# Altium schematic sheet FPGA.SchDoc: FPGA
size A2; Author: M.Beldyga; CompanyName: WUT ISE; DrawnBy: M.Beldyga; Organization: WUT ISE; Address1: PW ISE; Address2: Nowowiejska 15/19 00-665 Warsaw; Address3: micbeldyga@gmail.com; SheetNumber: 10; SheetTotal: 10; ModifiedBy: -; CheckedDate: -; DivGrp: WUT ISE; Designer: M.Beldyga; ModifiedDate: -; ProjectName: Sensor Box
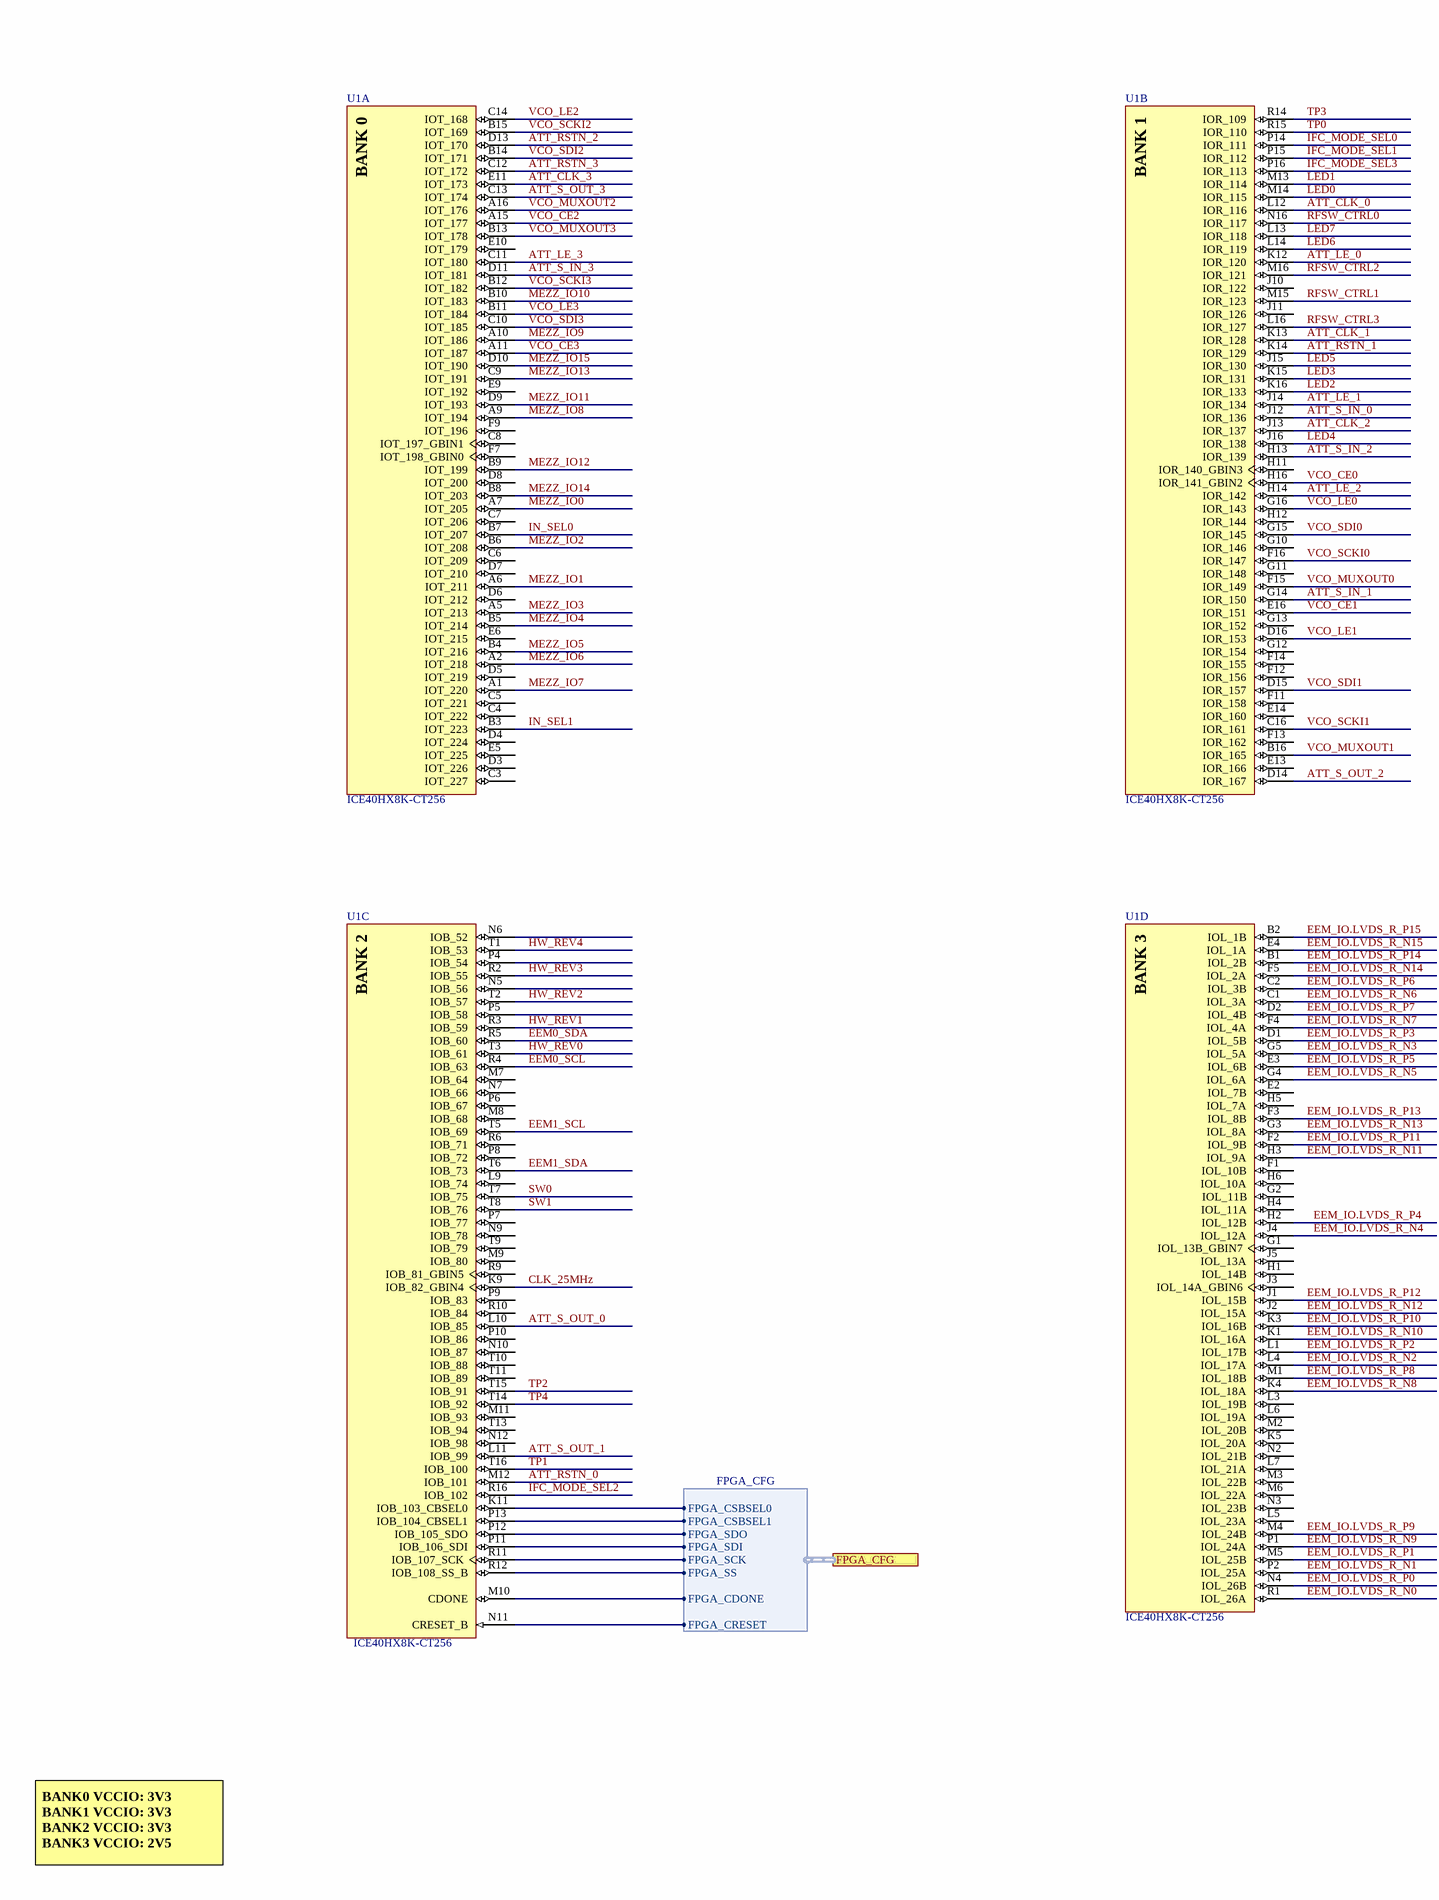
[diagram p0: FPGA.SchDoc, left]
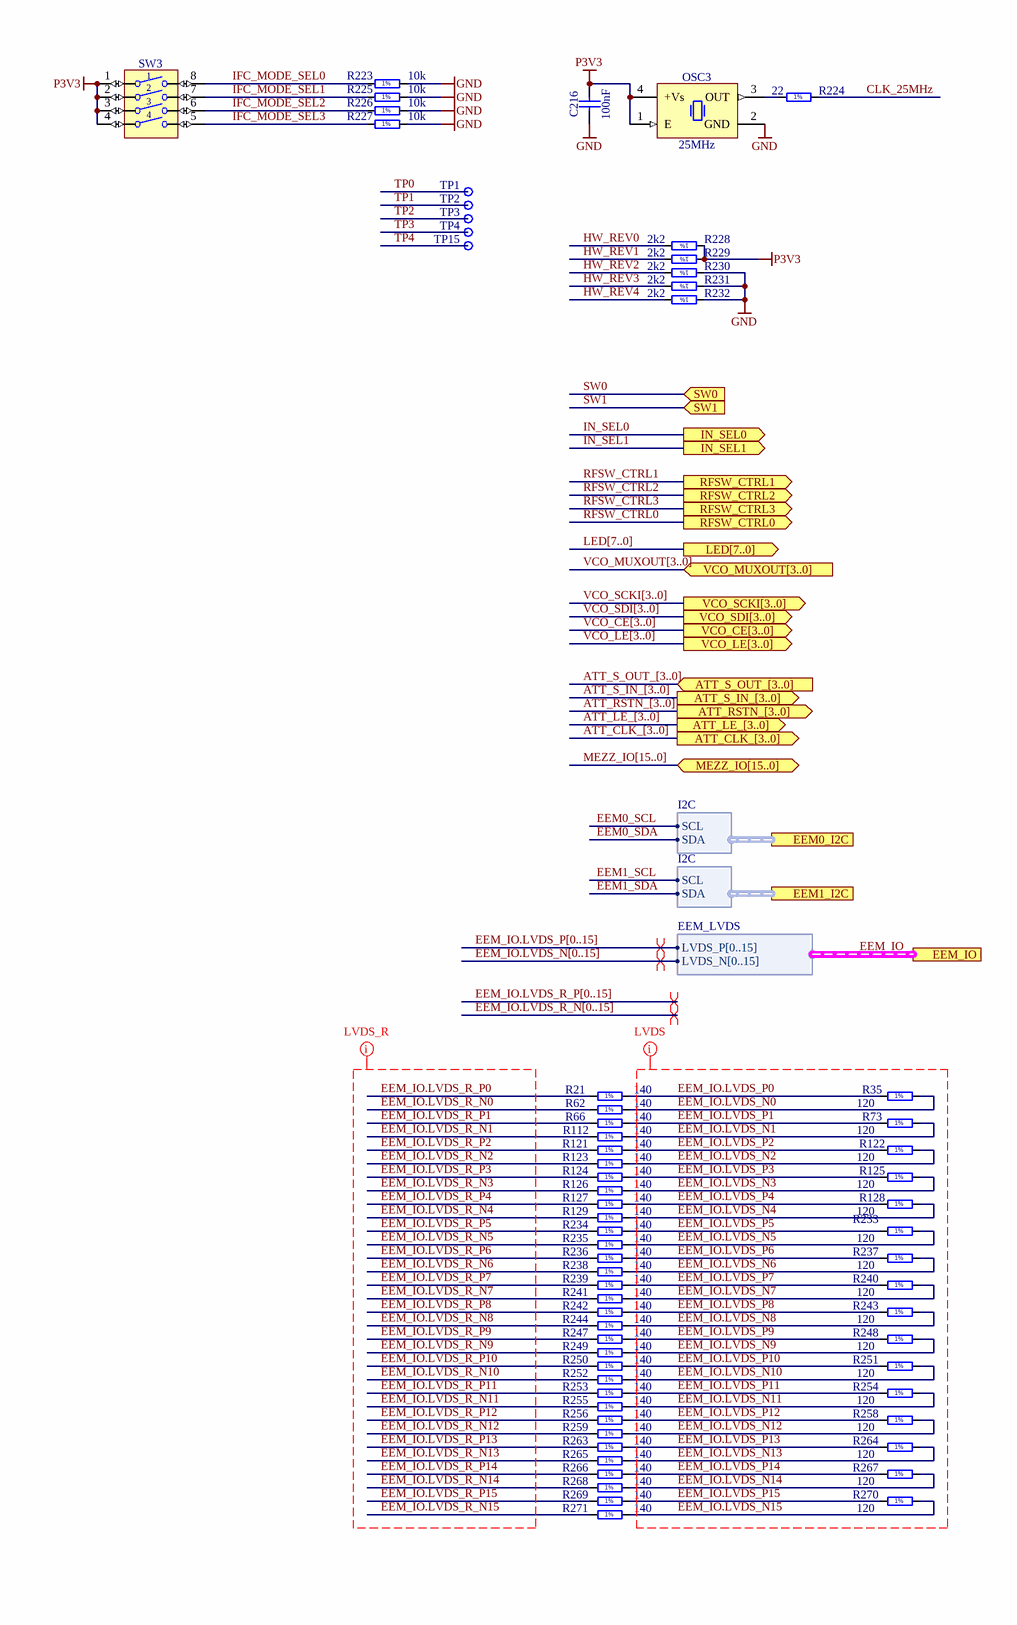
[diagram p1: FPGA.SchDoc, right]

## Parts
C216  100nF  [CAPC1005X55N]
OSC3  25MHz  [OSC_IQD_CFPS-39]
R21  140  [RESC0603X28N]
R35  120  [RESC1005X40N]
R62  140  [RESC0603X28N]
R66  140  [RESC0603X28N]
R73  120  [RESC1005X40N]
R112  140  [RESC0603X28N]
R121  140  [RESC0603X28N]
R122  120  [RESC1005X40N]
R123  140  [RESC0603X28N]
R124  140  [RESC0603X28N]
R125  120  [RESC1005X40N]
R126  140  [RESC0603X28N]
R127  140  [RESC0603X28N]
R128  120  [RESC1005X40N]
R129  140  [RESC0603X28N]
R223  10k  [RESC1005X40N]
R224  22  [RESC1005X40N]
R225  10k  [RESC1005X40N]
R226  10k  [RESC1005X40N]
R227  10k  [RESC1005X40N]
R228  2k2  [RESC1005X40N]
R229  2k2  [RESC1005X40N]
R230  2k2  [RESC1005X40N]
R231  2k2  [RESC1005X40N]
R232  2k2  [RESC1005X40N]
R233  120  [RESC1005X40N]
R234  140  [RESC0603X28N]
R235  140  [RESC0603X28N]
R236  140  [RESC0603X28N]
R237  120  [RESC1005X40N]
R238  140  [RESC0603X28N]
R239  140  [RESC0603X28N]
R240  120  [RESC1005X40N]
R241  140  [RESC0603X28N]
R242  140  [RESC0603X28N]
R243  120  [RESC1005X40N]
R244  140  [RESC0603X28N]
R247  140  [RESC0603X28N]
R248  120  [RESC1005X40N]
R249  140  [RESC0603X28N]
R250  140  [RESC0603X28N]
R251  120  [RESC1005X40N]
R252  140  [RESC0603X28N]
R253  140  [RESC0603X28N]
R254  120  [RESC1005X40N]
R255  140  [RESC0603X28N]
R256  140  [RESC0603X28N]
R258  120  [RESC1005X40N]
R259  140  [RESC0603X28N]
R263  140  [RESC0603X28N]
R264  120  [RESC1005X40N]
R265  140  [RESC0603X28N]
R266  140  [RESC0603X28N]
R267  120  [RESC1005X40N]
R268  140  [RESC0603X28N]
R269  140  [RESC0603X28N]
R270  120  [RESC1005X40N]
R271  140  [RESC0603X28N]
SW3  Switch  [SW_TYCO_1571983-4]  (value not drawn)
TP1  Test Point  [TPS127]  (value not drawn)
TP2  Test Point  [TPS127]  (value not drawn)
TP3  Test Point  [TPS127]  (value not drawn)
TP4  Test Point  [TPS127]  (value not drawn)
TP15  Test Point  [TPS127]  (value not drawn)
U1  ICE40HX8K-CT256  [LATC-caBGA-256]  (parts A,B,C,D of 5)

## Ports
ATT_CLK_[3..0] (out), ATT_LE_[3..0] (out), ATT_RSTN_[3..0] (out), ATT_S_IN_[3..0] (out), ATT_S_OUT_[3..0] (in), EEM0_I2C (harness I2C), EEM1_I2C (harness I2C), EEM_IO (harness EEM_LVDS), FPGA_CFG (harness FPGA_CFG), IN_SEL0 (out), IN_SEL1 (out), LED[7..0] (out), MEZZ_IO[15..0] (bidir), RFSW_CTRL0 (out), RFSW_CTRL1 (out), RFSW_CTRL2 (out), RFSW_CTRL3 (out), SW0 (in), SW1 (in), VCO_CE[3..0] (out), VCO_LE[3..0] (out), VCO_MUXOUT[3..0] (in), VCO_SCKI[3..0] (out), VCO_SDI[3..0] (out)

## Harnesses
FPGA_CFG: FPGA_CSBSEL0, FPGA_CSBSEL1, FPGA_SDO, FPGA_SDI, FPGA_SCK, FPGA_SS, FPGA_CDONE, FPGA_CRESET
I2C: SDA, SCL
EEM_LVDS: LVDS_P[0..15], LVDS_N[0..15]

## Nets
GND: C216.1 OSC3.2(GND) R223.2 R225.2 R226.2 R227.2 R230.1 R231.1 R232.1
P3V3: C216.2 OSC3.1(E) OSC3.4(+Vs) R228.1 R229.1 SW3.1 SW3.2 SW3.3 SW3.4
ATT_CLK_0: U1.L12(IOR_116)
ATT_CLK_1: U1.K13(IOR_128)
ATT_CLK_2: U1.J13(IOR_137)
ATT_CLK_3: U1.E11(IOT_173)
ATT_LE_0: U1.K12(IOR_120)
ATT_LE_1: U1.J14(IOR_134)
ATT_LE_2: U1.H14(IOR_142)
ATT_LE_3: U1.C11(IOT_180)
ATT_RSTN_0: U1.M12(IOB_101)
ATT_RSTN_1: U1.K14(IOR_129)
ATT_RSTN_2: U1.D13(IOT_170)
ATT_RSTN_3: U1.C12(IOT_172)
ATT_S_IN_0: U1.J12(IOR_136)
ATT_S_IN_1: U1.G14(IOR_150)
ATT_S_IN_2: U1.H13(IOR_139)
ATT_S_IN_3: U1.D11(IOT_181)
ATT_S_OUT_0: U1.L10(IOB_85)
ATT_S_OUT_1: U1.L11(IOB_99)
ATT_S_OUT_2: U1.D14(IOR_167)
ATT_S_OUT_3: U1.C13(IOT_174)
CLK_25MHz: R224.2 U1.K9(IOB_82_GBIN4)
EEM0_SCL: U1.R4(IOB_63) ; port EEM0_I2C.SCL
EEM0_SDA: U1.R5(IOB_60) ; port EEM0_I2C.SDA
EEM1_SCL: U1.T5(IOB_69) ; port EEM1_I2C.SCL
EEM1_SDA: U1.T6(IOB_73) ; port EEM1_I2C.SDA
EEM_IO.LVDS_N0: R35.2 R62.2
EEM_IO.LVDS_N1: R73.2 R112.2
EEM_IO.LVDS_N2: R122.2 R123.2
EEM_IO.LVDS_N3: R125.2 R126.2
EEM_IO.LVDS_N4: R128.2 R129.2
EEM_IO.LVDS_N5: R233.2 R235.2
EEM_IO.LVDS_N6: R237.2 R238.2
EEM_IO.LVDS_N7: R240.2 R241.2
EEM_IO.LVDS_N8: R243.2 R244.2
EEM_IO.LVDS_N9: R248.2 R249.2
EEM_IO.LVDS_N10: R251.2 R252.2
EEM_IO.LVDS_N11: R254.2 R255.2
EEM_IO.LVDS_N12: R258.2 R259.2
EEM_IO.LVDS_N13: R264.2 R265.2
EEM_IO.LVDS_N14: R267.2 R268.2
EEM_IO.LVDS_N15: R270.2 R271.2
EEM_IO.LVDS_P0: R21.2 R35.1
EEM_IO.LVDS_P1: R66.2 R73.1
EEM_IO.LVDS_P2: R121.2 R122.1
EEM_IO.LVDS_P3: R124.2 R125.1
EEM_IO.LVDS_P4: R127.2 R128.1
EEM_IO.LVDS_P5: R233.1 R234.2
EEM_IO.LVDS_P6: R236.2 R237.1
EEM_IO.LVDS_P7: R239.2 R240.1
EEM_IO.LVDS_P8: R242.2 R243.1
EEM_IO.LVDS_P9: R247.2 R248.1
EEM_IO.LVDS_P10: R250.2 R251.1
EEM_IO.LVDS_P11: R253.2 R254.1
EEM_IO.LVDS_P12: R256.2 R258.1
EEM_IO.LVDS_P13: R263.2 R264.1
EEM_IO.LVDS_P14: R266.2 R267.1
EEM_IO.LVDS_P15: R269.2 R270.1
EEM_IO.LVDS_R_N0: R62.1 U1.R1(IOL_26A)
EEM_IO.LVDS_R_N1: R112.1 U1.P2(IOL_25A)
EEM_IO.LVDS_R_N2: R123.1 U1.L4(IOL_17A)
EEM_IO.LVDS_R_N3: R126.1 U1.G5(IOL_5A)
EEM_IO.LVDS_R_N4: R129.1 U1.J4(IOL_12A)
EEM_IO.LVDS_R_N5: R235.1 U1.G4(IOL_6A)
EEM_IO.LVDS_R_N6: R238.1 U1.C1(IOL_3A)
EEM_IO.LVDS_R_N7: R241.1 U1.F4(IOL_4A)
EEM_IO.LVDS_R_N8: R244.1 U1.K4(IOL_18A)
EEM_IO.LVDS_R_N9: R249.1 U1.P1(IOL_24A)
EEM_IO.LVDS_R_N10: R252.1 U1.K1(IOL_16A)
EEM_IO.LVDS_R_N11: R255.1 U1.H3(IOL_9A)
EEM_IO.LVDS_R_N12: R259.1 U1.J2(IOL_15A)
EEM_IO.LVDS_R_N13: R265.1 U1.G3(IOL_8A)
EEM_IO.LVDS_R_N14: R268.1 U1.F5(IOL_2A)
EEM_IO.LVDS_R_N15: R271.1 U1.E4(IOL_1A)
EEM_IO.LVDS_R_P0: R21.1 U1.N4(IOL_26B)
EEM_IO.LVDS_R_P1: R66.1 U1.M5(IOL_25B)
EEM_IO.LVDS_R_P2: R121.1 U1.L1(IOL_17B)
EEM_IO.LVDS_R_P3: R124.1 U1.D1(IOL_5B)
EEM_IO.LVDS_R_P4: R127.1 U1.H2(IOL_12B)
EEM_IO.LVDS_R_P5: R234.1 U1.E3(IOL_6B)
EEM_IO.LVDS_R_P6: R236.1 U1.C2(IOL_3B)
EEM_IO.LVDS_R_P7: R239.1 U1.D2(IOL_4B)
EEM_IO.LVDS_R_P8: R242.1 U1.M1(IOL_18B)
EEM_IO.LVDS_R_P9: R247.1 U1.M4(IOL_24B)
EEM_IO.LVDS_R_P10: R250.1 U1.K3(IOL_16B)
EEM_IO.LVDS_R_P11: R253.1 U1.F2(IOL_9B)
EEM_IO.LVDS_R_P12: R256.1 U1.J1(IOL_15B)
EEM_IO.LVDS_R_P13: R263.1 U1.F3(IOL_8B)
EEM_IO.LVDS_R_P14: R266.1 U1.B1(IOL_2B)
EEM_IO.LVDS_R_P15: R269.1 U1.B2(IOL_1B)
HW_REV0: R228.2 U1.T3(IOB_61)
HW_REV1: R229.2 U1.R3(IOB_59)
HW_REV2: R230.2 U1.T2(IOB_57)
HW_REV3: R231.2 U1.R2(IOB_55)
HW_REV4: R232.2 U1.T1(IOB_53)
IFC_MODE_SEL0: R223.1 SW3.8 U1.P14(IOR_111)
IFC_MODE_SEL1: R225.1 SW3.7 U1.P15(IOR_112)
IFC_MODE_SEL2: R226.1 SW3.6 U1.R16(IOB_102)
IFC_MODE_SEL3: R227.1 SW3.5 U1.P16(IOR_113)
IN_SEL0: U1.B7(IOT_207) ; port IN_SEL0
IN_SEL1: U1.B3(IOT_223) ; port IN_SEL1
LED0: U1.M14(IOR_115)
LED1: U1.M13(IOR_114)
LED2: U1.K16(IOR_133)
LED3: U1.K15(IOR_131)
LED4: U1.J16(IOR_138)
LED5: U1.J15(IOR_130)
LED6: U1.L14(IOR_119)
LED7: U1.L13(IOR_118)
MEZZ_IO0: U1.A7(IOT_205)
MEZZ_IO1: U1.A6(IOT_211)
MEZZ_IO2: U1.B6(IOT_208)
MEZZ_IO3: U1.A5(IOT_213)
MEZZ_IO4: U1.B5(IOT_214)
MEZZ_IO5: U1.B4(IOT_216)
MEZZ_IO6: U1.A2(IOT_218)
MEZZ_IO7: U1.A1(IOT_220)
MEZZ_IO8: U1.A9(IOT_194)
MEZZ_IO9: U1.A10(IOT_186)
MEZZ_IO10: U1.B10(IOT_183)
MEZZ_IO11: U1.D9(IOT_193)
MEZZ_IO12: U1.B9(IOT_199)
MEZZ_IO13: U1.C9(IOT_191)
MEZZ_IO14: U1.B8(IOT_203)
MEZZ_IO15: U1.D10(IOT_190)
RFSW_CTRL0: U1.N16(IOR_117) ; port RFSW_CTRL0
RFSW_CTRL1: U1.M15(IOR_123) ; port RFSW_CTRL1
RFSW_CTRL2: U1.M16(IOR_121) ; port RFSW_CTRL2
RFSW_CTRL3: U1.L16(IOR_127) ; port RFSW_CTRL3
SW0: U1.T7(IOB_75) ; port SW0
SW1: U1.T8(IOB_76) ; port SW1
TP0: TP1.1 U1.R15(IOR_110)
TP1: TP2.1 U1.T16(IOB_100)
TP2: TP3.1 U1.T15(IOB_91)
TP3: TP4.1 U1.R14(IOR_109)
TP4: TP15.1 U1.T14(IOB_92)
VCO_CE0: U1.H16(IOR_141_GBIN2)
VCO_CE1: U1.E16(IOR_151)
VCO_CE2: U1.A15(IOT_177)
VCO_CE3: U1.A11(IOT_187)
VCO_LE0: U1.G16(IOR_143)
VCO_LE1: U1.D16(IOR_153)
VCO_LE2: U1.C14(IOT_168)
VCO_LE3: U1.B11(IOT_184)
VCO_MUXOUT0: U1.F15(IOR_149)
VCO_MUXOUT1: U1.B16(IOR_165)
VCO_MUXOUT2: U1.A16(IOT_176)
VCO_MUXOUT3: U1.B13(IOT_178)
VCO_SCKI0: U1.F16(IOR_147)
VCO_SCKI1: U1.C16(IOR_161)
VCO_SCKI2: U1.B15(IOT_169)
VCO_SCKI3: U1.B12(IOT_182)
VCO_SDI0: U1.G15(IOR_145)
VCO_SDI1: U1.D15(IOR_157)
VCO_SDI2: U1.B14(IOT_171)
VCO_SDI3: U1.C10(IOT_185)
NetOSC3_3: OSC3.3(OUT) R224.1
NetU1_K11: U1.K11(IOB_103_CBSEL0) ; port FPGA_CFG.FPGA_CSBSEL0
NetU1_M10: U1.M10(CDONE) ; port FPGA_CFG.FPGA_CDONE
NetU1_N11: U1.N11(CRESET_B) ; port FPGA_CFG.FPGA_CRESET
NetU1_P11: U1.P11(IOB_106_SDI) ; port FPGA_CFG.FPGA_SDI
NetU1_P12: U1.P12(IOB_105_SDO) ; port FPGA_CFG.FPGA_SDO
NetU1_P13: U1.P13(IOB_104_CBSEL1) ; port FPGA_CFG.FPGA_CSBSEL1
NetU1_R11: U1.R11(IOB_107_SCK) ; port FPGA_CFG.FPGA_SCK
NetU1_R12: U1.R12(IOB_108_SS_B) ; port FPGA_CFG.FPGA_SS

Not connected (* = marked no-connect by the designer): U1 C3(IOT_227) C4(IOT_222) C5(IOT_221) C6(IOT_209) C7(IOT_206) C8(IOT_197_GBIN1) D3(IOT_226) D4(IOT_224) D5(IOT_219) D6(IOT_212) D7(IOT_210) D8(IOT_200) E2(IOL_7B) E5(IOT_225) E6(IOT_215) E9(IOT_192) E10(IOT_179) E13(IOR_166) E14(IOR_160) F1(IOL_10B) F7(IOT_198_GBIN0) F9(IOT_196) F11(IOR_158) F12(IOR_156) F13(IOR_162) F14(IOR_155) G1(IOL_13B_GBIN7) G2(IOL_11B) G10(IOR_146) G11(IOR_148) G12(IOR_154) G13(IOR_152) H1(IOL_14B) H4(IOL_11A) H5(IOL_7A) H6(IOL_10A) H11(IOR_140_GBIN3) H12(IOR_144) J3(IOL_14A_GBIN6) J5(IOL_13A) J10(IOR_122) J11(IOR_126) K5(IOL_20A) L3(IOL_19B) L5(IOL_23A) L6(IOL_19A) L7(IOL_21A) L9(IOB_74) M2(IOL_20B) M3(IOL_22B) M6(IOL_22A) M7(IOB_64) M8(IOB_68) M9(IOB_80) M11(IOB_93) N2(IOL_21B) N3(IOL_23B) N5(IOB_56) N6(IOB_52) N7(IOB_66) N9(IOB_78) N10(IOB_87) N12(IOB_98) P4(IOB_54) P5(IOB_58) P6(IOB_67) P7(IOB_77) P8(IOB_72) P9(IOB_83) P10(IOB_86) R6(IOB_71) R9(IOB_81_GBIN5) R10(IOB_84) T9(IOB_79) T10(IOB_88) T11(IOB_89) T13(IOB_94)

## Buses and harness runs
bus ATT_CLK_[3..0] = port ATT_CLK_[3..0]
bus ATT_LE_[3..0] = port ATT_LE_[3..0]
bus ATT_RSTN_[3..0] = port ATT_RSTN_[3..0]
bus ATT_S_IN_[3..0] = port ATT_S_IN_[3..0]
bus ATT_S_OUT_[3..0] = port ATT_S_OUT_[3..0]
bus EEM_IO.LVDS_N[0..15]
bus EEM_IO.LVDS_P[0..15]
bus EEM_IO.LVDS_R_N[0..15]
bus EEM_IO.LVDS_R_P[0..15]
bus LED[7..0] = port LED[7..0]
bus MEZZ_IO[15..0] = port MEZZ_IO[15..0]
bus VCO_CE[3..0] = port VCO_CE[3..0]
bus VCO_LE[3..0] = port VCO_LE[3..0]
bus VCO_MUXOUT[3..0] = port VCO_MUXOUT[3..0]
bus VCO_SCKI[3..0] = port VCO_SCKI[3..0]
bus VCO_SDI[3..0] = port VCO_SDI[3..0]
harness EEM_IO = port EEM_IO

## Layout directives
differential pair; differential pair class Diff_100Ohm: (no net found under the mark)
net class LVDS: EEM_IO.LVDS_N0, EEM_IO.LVDS_N1, EEM_IO.LVDS_N2, EEM_IO.LVDS_N3, EEM_IO.LVDS_N4, EEM_IO.LVDS_N5, EEM_IO.LVDS_N6, EEM_IO.LVDS_N7, EEM_IO.LVDS_N8, EEM_IO.LVDS_N9, EEM_IO.LVDS_N10, EEM_IO.LVDS_N11, EEM_IO.LVDS_N12, EEM_IO.LVDS_N13, EEM_IO.LVDS_N14, EEM_IO.LVDS_N15, EEM_IO.LVDS_P0, EEM_IO.LVDS_P1, EEM_IO.LVDS_P2, EEM_IO.LVDS_P3, EEM_IO.LVDS_P4, EEM_IO.LVDS_P5, EEM_IO.LVDS_P6, EEM_IO.LVDS_P7, EEM_IO.LVDS_P8, EEM_IO.LVDS_P9, EEM_IO.LVDS_P10, EEM_IO.LVDS_P11, EEM_IO.LVDS_P12, EEM_IO.LVDS_P13, EEM_IO.LVDS_P14, EEM_IO.LVDS_P15
net class LVDS_R: EEM_IO.LVDS_R_N0, EEM_IO.LVDS_R_N1, EEM_IO.LVDS_R_N2, EEM_IO.LVDS_R_N3, EEM_IO.LVDS_R_N4, EEM_IO.LVDS_R_N5, EEM_IO.LVDS_R_N6, EEM_IO.LVDS_R_N7, EEM_IO.LVDS_R_N8, EEM_IO.LVDS_R_N9, EEM_IO.LVDS_R_N10, EEM_IO.LVDS_R_N11, EEM_IO.LVDS_R_N12, EEM_IO.LVDS_R_N13, EEM_IO.LVDS_R_N14, EEM_IO.LVDS_R_N15, EEM_IO.LVDS_R_P0, EEM_IO.LVDS_R_P1, EEM_IO.LVDS_R_P2, EEM_IO.LVDS_R_P3, EEM_IO.LVDS_R_P4, EEM_IO.LVDS_R_P5, EEM_IO.LVDS_R_P6, EEM_IO.LVDS_R_P7, EEM_IO.LVDS_R_P8, EEM_IO.LVDS_R_P9, EEM_IO.LVDS_R_P10, EEM_IO.LVDS_R_P11, EEM_IO.LVDS_R_P12, EEM_IO.LVDS_R_P13, EEM_IO.LVDS_R_P14, EEM_IO.LVDS_R_P15

## Notes on the sheet
- BANK0 VCCIO: 3V3
  BANK1 VCCIO: 3V3
  BANK2 VCCIO: 3V3
  BANK3 VCCIO: 2V5
- Project/Equipment
- Document
- Designer
- Drawn by
- Check.by
- Last Mod.
- Contact
- File
- Print Date
- Sheet
- Size
- A2
- of
- Rev
- (in symbol CMP-0962-00001-1, part A) BANK 0
- (in symbol CMP-0962-00001-1, part B) BANK 1
- (in symbol CMP-0962-00001-1, part C) BANK 2
- (in symbol CMP-0962-00001-1, part D) BANK 3
- (in symbol R0201_140R_1%_0.05W_200PPM) 1%
- (in symbol R0402_2K2_1%_0.0625W_100PPM) 1%
- (in symbol R0402_10K_1%_0.0625W_100PPM) 1%
- (in symbol R0402_22R_1%_0.0625W_100PPM) 1%
- (in symbol R0402_120R_1%_0.0625W_100PPM) 1%

## Library data of the parts
C216 = CC0402_100NF_16V_10%_X5R: Non-polarised capacitor; Part Description: SMD Multilayer Chip Ceramic Capacitor; Manufacturer: GENERIC; Manufacturer1 Part Number: GRM155R61C104KA88D; Voltage: 16V; TC: X5R; Tolerance: ±10%; Part Number: CC0402_100NF_16V_10%_X5R; Component Kind: Standard; Component Type: Standard; Pin Count: 2; Value: 100nF; Status: None; Manufacturer Part Number: CC0402_100NF_16V_10%_X5R; Case: 0402; Mounted: Yes; Socket: No; SMD: Yes; Sense: No; Manufacturer1 Example: MURATA; Manufacturer1 ComponentHeight: 0.55mm; HelpURL: \\cern.ch\dfs\Applications\Altium\Datasheets\CC0402_X5R_MURATA_GRM.pdf; Author: CERN DEM JLC; CreateDate: 10.12.2013; LatestRevisionDate: 10.12.2013
OSC3 = OSC_25MHZ_IQD_LFSPXO025165: Oscillator 4 pins 1=E 2=GND 3=OUT 4=+Vs; Part Description: 3.3V, ±50ppm, 15pF, -40 to 85°C, CMOS Surface Mount Clock Oscillator (CFPS-39 Series); Manufacturer: IQD FREQUENCY PRODUCTS; PressFit: No; Bonding: No; Part Number: OSC_25MHZ_IQD_LFSPXO025165; Component Kind: Standard; Component Type: Standard; PackageDescription: Oscillator, Corner Concave, 2.20mm Pitch, 4 Pins, 2.70mm L X 3.40mm W X 1.20mm H, CFPS-39 Series; Value: 25MHz; Manufacturer Part Number: LFSPXO025165; Pin Count: 4; Mounted: Yes; Socket: No; SMD: Yes; Sense: No; ComponentHeight: 1.2mm; HelpURL: \\cern.ch\dfs\Applications\Altium\Datasheets\OSC_IQD_LFSPXO025165.pdf; Author: CERN DEM JLC; CreateDate: 02.12.2010; LatestRevisionDate: 03.11.2016
R21 R62 R66 R112 R121 R123 R124 R126 R127 R129 R234-R236 R238 R239 R241 R242 R244 R247 R249 R250 R252 R253 R255 R256 R259 R263 R265 R266 R268 R269 R271 = R0201_140R_1%_0.05W_200PPM: Resistor - 1%; Part Description: Thick Film Chip Resistor; Manufacturer: GENERIC; Manufacturer1 Part Number: CRCW0201140RFNED; Power: 0.05W; TC: ±200ppm/°C; PressFit: No; Part Number: R0201_140R_1%_0.05W_200PPM; Component Kind: Standard; Component Type: Standard; Pin Count: 2; Value: 140; Status: Not Recommended; Tolerance: ±1%; Manufacturer Part Number: R0201_140R_1%_0.05W_200PPM; Case: 0201; Mounted: Yes; Sense: No; Socket: No; SMD: Yes; Manufacturer1 Example: VISHAY; Manufacturer1 ComponentHeight: 0.27mm; HelpURL: \\cern.ch\dfs\Applications\Altium\Datasheets\R0201_VISHAY_CRCW e3.pdf; Author: CERN DEM MR; CreateDate: 26/01/2016; LatestRevisionDate: 26/01/2016
R35 R73 R122 R125 R128 R233 R237 R240 R243 R248 R251 R254 R258 R264 R267 R270 = R0402_120R_1%_0.0625W_100PPM: Resistor - 1%; Part Description: General Purpose Thick Film Chip Resistor; Manufacturer: GENERIC; Manufacturer1 Part Number: 232270671201L; TC: ±100ppm/°C; PressFit: No; Part Number: R0402_120R_1%_0.0625W_100PPM; Component Kind: Standard; Component Type: Standard; Pin Count: 2; Value: 120; Status: Not Recommended; Power: 0.0625W; Tolerance: ±1%; Manufacturer Part Number: R0402_120R_1%_0.0625W_100PPM; Case: 0402; Mounted: Yes; Sense: No; Socket: No; SMD: Yes; Manufacturer1 Example: YAGEO PHYCOMP; Manufacturer1 ComponentHeight: 0.4mm; HelpURL: \\cern.ch\dfs\Applications\Altium\Datasheets\R0402_Phycomp_RC0402.pdf; Author: CERN DEM JLC; CreateDate: 03.12.2007; LatestRevisionDate: 17.10.2012
R223 R225-R227 = R0402_10K_1%_0.0625W_100PPM: Resistor - 1%; Part Description: General Purpose Thick Film Chip Resistor; Manufacturer: GENERIC; Manufacturer1 Part Number: 232270671003L; TC: ±100ppm/°C; Part Number: R0402_10K_1%_0.0625W_100PPM; Component Kind: Standard; Component Type: Standard; Pin Count: 2; Value: 10k; Status: Not recommended; Power: 0.0625W; Tolerance: ±1%; Manufacturer Part Number: R0402_10K_1%_0.0625W_100PPM; Case: 0402; Mounted: Yes; Sense: No; Socket: No; SMD: Yes; Manufacturer1 Example: YAGEO PHYCOMP; Manufacturer1 ComponentHeight: 0.4mm; HelpURL: \\cern.ch\dfs\Applications\Altium\Datasheets\R0402_Phycomp_RC0402.pdf; Author: CERN DEM JLC; CreateDate: 03.12.2007; LatestRevisionDate: 17.10.2012
R224 = R0402_22R_1%_0.0625W_100PPM: Resistor - 1%; Part Description: General Purpose Thick Film Chip Resistor; Manufacturer: GENERIC; Manufacturer1 Part Number: 232270672209L; TC: ±100ppm/°C; PressFit: No; Part Number: R0402_22R_1%_0.0625W_100PPM; Component Kind: Standard; Component Type: Standard; Pin Count: 2; Value: 22; Status: Not Recommended; Power: 0.0625W; Tolerance: ±1%; Manufacturer Part Number: R0402_22R_1%_0.0625W_100PPM; Case: 0402; Mounted: Yes; Sense: No; Socket: No; SMD: Yes; Manufacturer1 Example: YAGEO PHYCOMP; Manufacturer1 ComponentHeight: 0.4mm; HelpURL: \\cern.ch\dfs\Applications\Altium\Datasheets\R0402_Phycomp_RC0402.pdf; Author: CERN DEM JLC; CreateDate: 03/12/2007; LatestRevisionDate: 17/10/2012
R228-R232 = R0402_2K2_1%_0.0625W_100PPM: Resistor - 1%; Part Description: General Purpose Thick Film Chip Resistor; Manufacturer: GENERIC; Manufacturer1 Part Number: 232270672202L; TC: ±100ppm/°C; Table: Resistors SMD; Part Number: R0402_2K2_1%_0.0625W_100PPM; Component Kind: Standard; Component Type: Standard; Pin Count: 2; Value: 2k2; Status: Not recommended; Power: 0.0625W; Tolerance: ±1%; Manufacturer Part Number: R0402_2K2_1%_0.0625W_100PPM; Case: 0402; Mounted: Yes; Socket: No; SMD: Yes; Manufacturer1 Example: YAGEO PHYCOMP; Manufacturer1 ComponentHeight: 0.4mm; HelpURL: \\cern.ch\dfs\Applications\Altium\Datasheets\R0402_Phycomp_RC0402.pdf; Author: CERN DEM JLC; CreateDate: 2007-12-03; LatestRevisionDate: 2012-10-17
SW3 = SW_TYCO_1571983-4: 4 Ways SPST DIP Switch; Part Description: 4 Way SPST SMD DIP Switch, Latched, Contact Rating 0.025A 24VDC; Manufacturer: TYCO; Manufacturer Part Number: 1571983-4 or GDH04S04; PressFit: No; Part Number: SW_TYCO_1571983-4; Component Kind: Standard; Component Type: Standard; Pin Count: 8; PackageDescription: Pitch 1.27mm,  Body 6.2x6.2mm, 4 Ways SPST Surface-Mount DIP Switch, TYCO GDH Series; Family: Switch; Mounted: Yes; Socket: No; SMD: Yes; Sense: No; Status: None; ComponentHeight: 2.31mm; HelpURL: \\cern.ch\dfs\Applications\Altium\Datasheets\SW_TYCO_1571983-4.pdf; Author: CERN DEM JLC; CreateDate: 08/01/2009; LatestRevisionDate: 08/01/2009
TP1-TP4 TP15 = SMD_PAD_1.27X1.27MM: Part Description: 1.27mm x 1.27mm PCB Copper Area (SMD Test Point); Mounted: No; Part Number: SMD_PAD_1.27X1.27MM; Component Kind: Standard (No BOM); Component Type: Standard (No BOM); Pin Count: 1; Family: Test Point; Socket: No; SMD: Yes; Sense: No; Status: None; ComponentHeight: 0mm; HelpURL: Undefined; Author: CERN DEM JLC; CreateDate: 12.01.2008; LatestRevisionDate: 12.01.2008; PackageDescription: 1.27mm x 1.27mm PCB Copper Area (SMD Test Point)
U1 = CMP-0962-00001-1: iCE40 HX8K Series FPGA Family, 7680 Logic Cells, 1.2 V Core, 128 K Embedded RAM Bits, 256-ball caBGA, Pb-Free, Tray; Manufacturer: Lattice Semiconductor; Supply Voltage: 1.2V; Phase-Locked Loops: 2; Logic Cells: 7680; Embedded RAM Bits: 128K; PackageReference: caBGA-256; PackageDescription: 256-Ball Chip Array Ball Grid Array, Body 14 x 14 mm, Pitch 0.8 mm; RoHS: TRUE; Packing: Tray; Mounting Technology: Surface Mount; ComponentLink3URL: http://www.latticesemi.com/lit/docs/package/pkg.pdf; ComponentLink1Description: Manufacturer URL; ComponentLink3Description: Package Specification; Code_JEDEC: MO-275; PackageVersion: Rev. 03.9, 02/2013; ComponentLink1URL: http://www.latticesemi.com/en; ComponentLink2URL: http://www.latticesemi.com/~/media/Documents/DataSheets/iCE/iCE40LPHXFamilyDataSheet.pdf; Manufacturer Part Number: ICE40HX8K-CT256; ComponentLink2Description: Datasheet; DatasheetVersion: Rev. 02.9